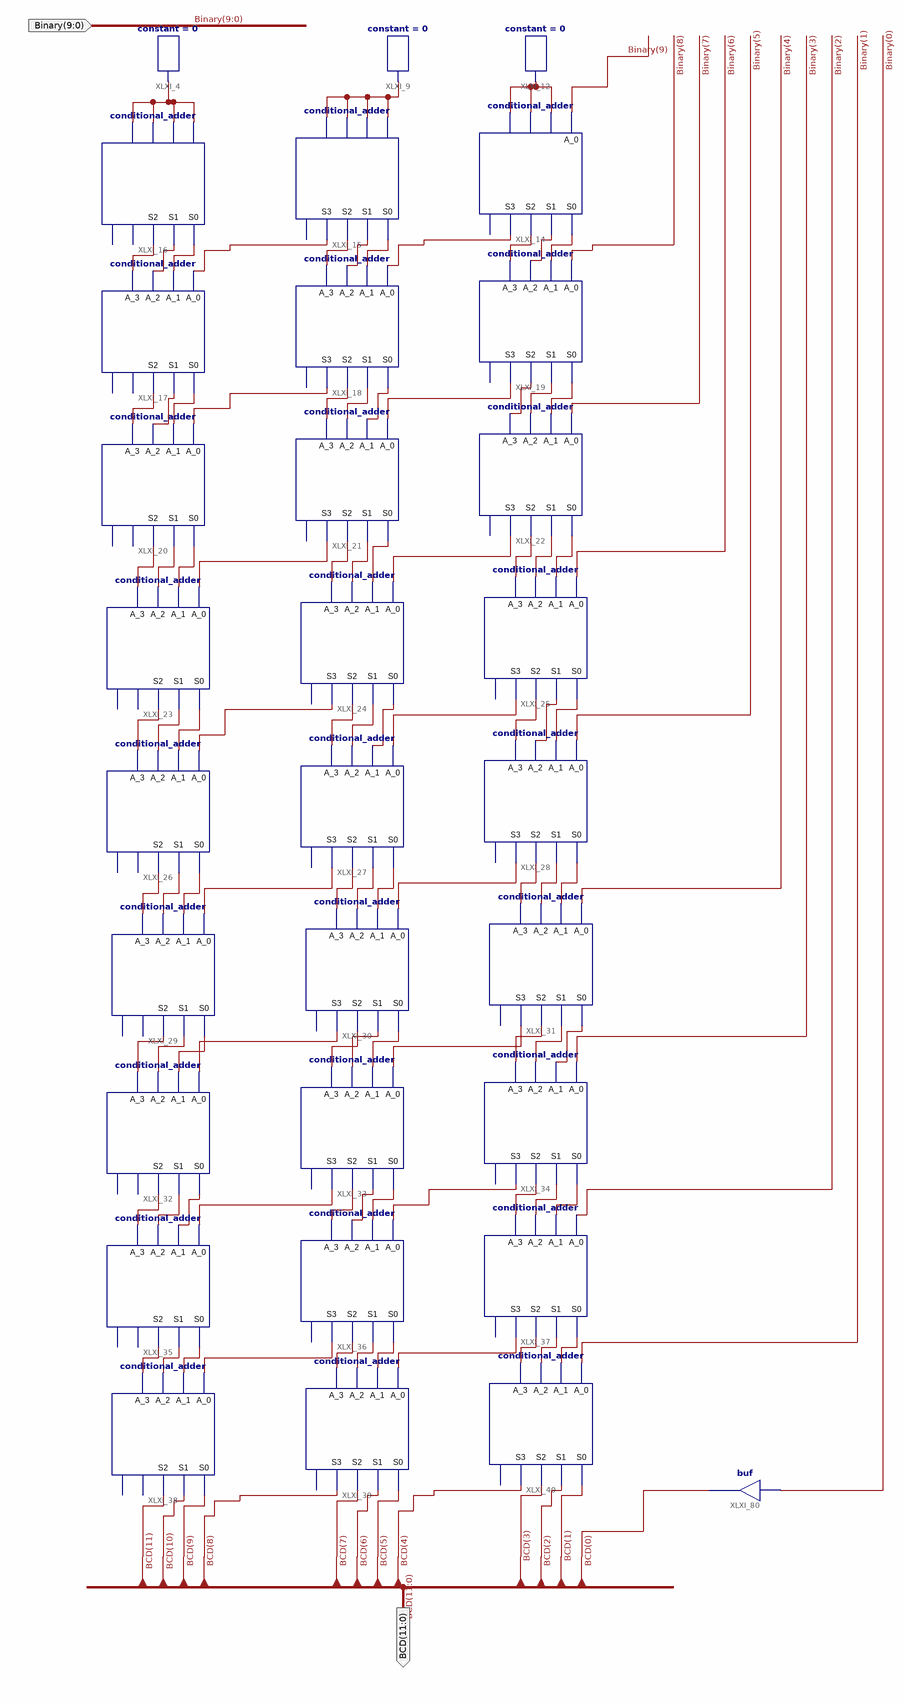
[diagram p0: schematic sheet 1]
// Xilinx ISE schematic Binary_to_BCD_encoder.sch (artix7) as structural Verilog: 31 symbols, 2 ports
module Binary_to_BCD_encoder (
  input  [9:0] Binary,
  output [11:0] BCD
);

  wire XLXN_14, XLXN_15, XLXN_16, XLXN_17, XLXN_18, XLXN_20, XLXN_21, XLXN_22, XLXN_23, XLXN_24, XLXN_25,
       XLXN_26, XLXN_27, XLXN_29, XLXN_30, XLXN_31, XLXN_32, XLXN_33, XLXN_34, XLXN_35, XLXN_36, XLXN_37,
       XLXN_38, XLXN_39, XLXN_47, XLXN_48, XLXN_49, XLXN_50, XLXN_51, XLXN_52, XLXN_54, XLXN_55, XLXN_56,
       XLXN_57, XLXN_58, XLXN_59, XLXN_60, XLXN_61, XLXN_62, XLXN_63, XLXN_64, XLXN_65, XLXN_66, XLXN_67,
       XLXN_68, XLXN_70, XLXN_71, XLXN_72, XLXN_73, XLXN_74, XLXN_75, XLXN_76, XLXN_77, XLXN_78, XLXN_79,
       XLXN_80, XLXN_81, XLXN_82, XLXN_83, XLXN_84, XLXN_85, XLXN_86, XLXN_87, XLXN_88, XLXN_89, XLXN_90,
       XLXN_91, XLXN_92, XLXN_93, XLXN_94, XLXN_95, XLXN_96, XLXN_97, XLXN_98, XLXN_99, XLXN_100, XLXN_101,
       XLXN_102, XLXN_103, XLXN_130, XLXN_131, XLXN_133, XLXN_134, XLXN_135, XLXN_136, XLXN_137, XLXN_138,
       XLXN_139, XLXN_140, XLXN_141, XLXN_142;

  constant #(.CValue("0")) XLXI_4 (.O(XLXN_131));
  constant #(.CValue("0")) XLXI_9 (.O(XLXN_130));
  constant #(.CValue("0")) XLXI_12 (.O(XLXN_14));
  conditional_adder XLXI_14 (
    .A_0(Binary[9]), .A_1(XLXN_14), .A_2(XLXN_14), .A_3(XLXN_14), .S0(XLXN_15), .S1(XLXN_16), .S2(XLXN_17),
    .S3(XLXN_18));  // open: C
  conditional_adder XLXI_15 (
    .A_0(XLXN_130), .A_1(XLXN_130), .A_2(XLXN_130), .A_3(XLXN_130), .S0(XLXN_133), .S1(XLXN_134),
    .S2(XLXN_135), .S3(XLXN_136));  // open: C
  conditional_adder XLXI_16 (
    .A_0(XLXN_131), .A_1(XLXN_131), .A_2(XLXN_131), .A_3(XLXN_131), .S0(XLXN_137), .S1(XLXN_138),
    .S2(XLXN_139));  // open: C, S3
  conditional_adder XLXI_17 (
    .A_0(XLXN_136), .A_1(XLXN_137), .A_2(XLXN_138), .A_3(XLXN_139), .S0(XLXN_140), .S1(XLXN_141),
    .S2(XLXN_142));  // open: C, S3
  conditional_adder XLXI_18 (
    .A_0(XLXN_18), .A_1(XLXN_133), .A_2(XLXN_134), .A_3(XLXN_135), .S0(XLXN_24), .S1(XLXN_25), .S2(XLXN_26),
    .S3(XLXN_27));  // open: C
  conditional_adder XLXI_19 (
    .A_0(Binary[8]), .A_1(XLXN_15), .A_2(XLXN_16), .A_3(XLXN_17), .S0(XLXN_20), .S1(XLXN_21), .S2(XLXN_22),
    .S3(XLXN_23));  // open: C
  conditional_adder XLXI_20 (
    .A_0(XLXN_27), .A_1(XLXN_140), .A_2(XLXN_141), .A_3(XLXN_142), .S0(XLXN_37), .S1(XLXN_38), .S2(XLXN_39));  // open: C, S3
  conditional_adder XLXI_21 (
    .A_0(XLXN_23), .A_1(XLXN_24), .A_2(XLXN_25), .A_3(XLXN_26), .S0(XLXN_33), .S1(XLXN_34), .S2(XLXN_35),
    .S3(XLXN_36));  // open: C
  conditional_adder XLXI_22 (
    .A_0(Binary[7]), .A_1(XLXN_20), .A_2(XLXN_21), .A_3(XLXN_22), .S0(XLXN_29), .S1(XLXN_30), .S2(XLXN_31),
    .S3(XLXN_32));  // open: C
  conditional_adder XLXI_23 (
    .A_0(XLXN_36), .A_1(XLXN_37), .A_2(XLXN_38), .A_3(XLXN_39), .S0(XLXN_56), .S1(XLXN_57), .S2(XLXN_58));  // open: C, S3
  conditional_adder XLXI_24 (
    .A_0(XLXN_32), .A_1(XLXN_33), .A_2(XLXN_34), .A_3(XLXN_35), .S0(XLXN_51), .S1(XLXN_52), .S2(XLXN_54),
    .S3(XLXN_55));  // open: C
  conditional_adder XLXI_25 (
    .A_0(Binary[6]), .A_1(XLXN_29), .A_2(XLXN_30), .A_3(XLXN_31), .S0(XLXN_47), .S1(XLXN_48), .S2(XLXN_49),
    .S3(XLXN_50));  // open: C
  conditional_adder XLXI_26 (
    .A_0(XLXN_55), .A_1(XLXN_56), .A_2(XLXN_57), .A_3(XLXN_58), .S0(XLXN_67), .S1(XLXN_68), .S2(XLXN_70));  // open: C, S3
  conditional_adder XLXI_27 (
    .A_0(XLXN_50), .A_1(XLXN_51), .A_2(XLXN_52), .A_3(XLXN_54), .S0(XLXN_63), .S1(XLXN_64), .S2(XLXN_65),
    .S3(XLXN_66));  // open: C
  conditional_adder XLXI_28 (
    .A_0(Binary[5]), .A_1(XLXN_47), .A_2(XLXN_48), .A_3(XLXN_49), .S0(XLXN_59), .S1(XLXN_60), .S2(XLXN_61),
    .S3(XLXN_62));  // open: C
  conditional_adder XLXI_29 (
    .A_0(XLXN_66), .A_1(XLXN_67), .A_2(XLXN_68), .A_3(XLXN_70), .S0(XLXN_79), .S1(XLXN_80), .S2(XLXN_81));  // open: C, S3
  conditional_adder XLXI_30 (
    .A_0(XLXN_62), .A_1(XLXN_63), .A_2(XLXN_64), .A_3(XLXN_65), .S0(XLXN_75), .S1(XLXN_76), .S2(XLXN_77),
    .S3(XLXN_78));  // open: C
  conditional_adder XLXI_31 (
    .A_0(Binary[4]), .A_1(XLXN_59), .A_2(XLXN_60), .A_3(XLXN_61), .S0(XLXN_71), .S1(XLXN_72), .S2(XLXN_73),
    .S3(XLXN_74));  // open: C
  conditional_adder XLXI_32 (
    .A_0(XLXN_78), .A_1(XLXN_79), .A_2(XLXN_80), .A_3(XLXN_81), .S0(XLXN_88), .S1(XLXN_92), .S2(XLXN_89));  // open: C, S3
  conditional_adder XLXI_33 (
    .A_0(XLXN_74), .A_1(XLXN_75), .A_2(XLXN_76), .A_3(XLXN_77), .S0(XLXN_85), .S1(XLXN_86), .S2(XLXN_91),
    .S3(XLXN_87));  // open: C
  conditional_adder XLXI_34 (
    .A_0(Binary[3]), .A_1(XLXN_71), .A_2(XLXN_72), .A_3(XLXN_73), .S0(XLXN_90), .S1(XLXN_82), .S2(XLXN_83),
    .S3(XLXN_84));  // open: C
  conditional_adder XLXI_35 (
    .A_0(XLXN_87), .A_1(XLXN_88), .A_2(XLXN_92), .A_3(XLXN_89), .S0(XLXN_101), .S1(XLXN_102), .S2(XLXN_103));  // open: C, S3
  conditional_adder XLXI_36 (
    .A_0(XLXN_84), .A_1(XLXN_85), .A_2(XLXN_86), .A_3(XLXN_91), .S0(XLXN_97), .S1(XLXN_98), .S2(XLXN_99),
    .S3(XLXN_100));  // open: C
  conditional_adder XLXI_37 (
    .A_0(Binary[2]), .A_1(XLXN_90), .A_2(XLXN_82), .A_3(XLXN_83), .S0(XLXN_93), .S1(XLXN_94), .S2(XLXN_95),
    .S3(XLXN_96));  // open: C
  conditional_adder XLXI_38 (
    .A_0(XLXN_100), .A_1(XLXN_101), .A_2(XLXN_102), .A_3(XLXN_103), .S0(BCD[9]), .S1(BCD[10]), .S2(BCD[11]));  // open: C, S3
  conditional_adder XLXI_39 (
    .A_0(XLXN_96), .A_1(XLXN_97), .A_2(XLXN_98), .A_3(XLXN_99), .S0(BCD[5]), .S1(BCD[6]), .S2(BCD[7]),
    .S3(BCD[8]));  // open: C
  conditional_adder XLXI_40 (
    .A_0(Binary[1]), .A_1(XLXN_93), .A_2(XLXN_94), .A_3(XLXN_95), .S0(BCD[1]), .S1(BCD[2]), .S2(BCD[3]),
    .S3(BCD[4]));  // open: C
  buf XLXI_80 (BCD[0], Binary[0]);
endmodule
